# EAGLE schematic ra8875_ez80_2_1 (EAGLE 7.3.0)
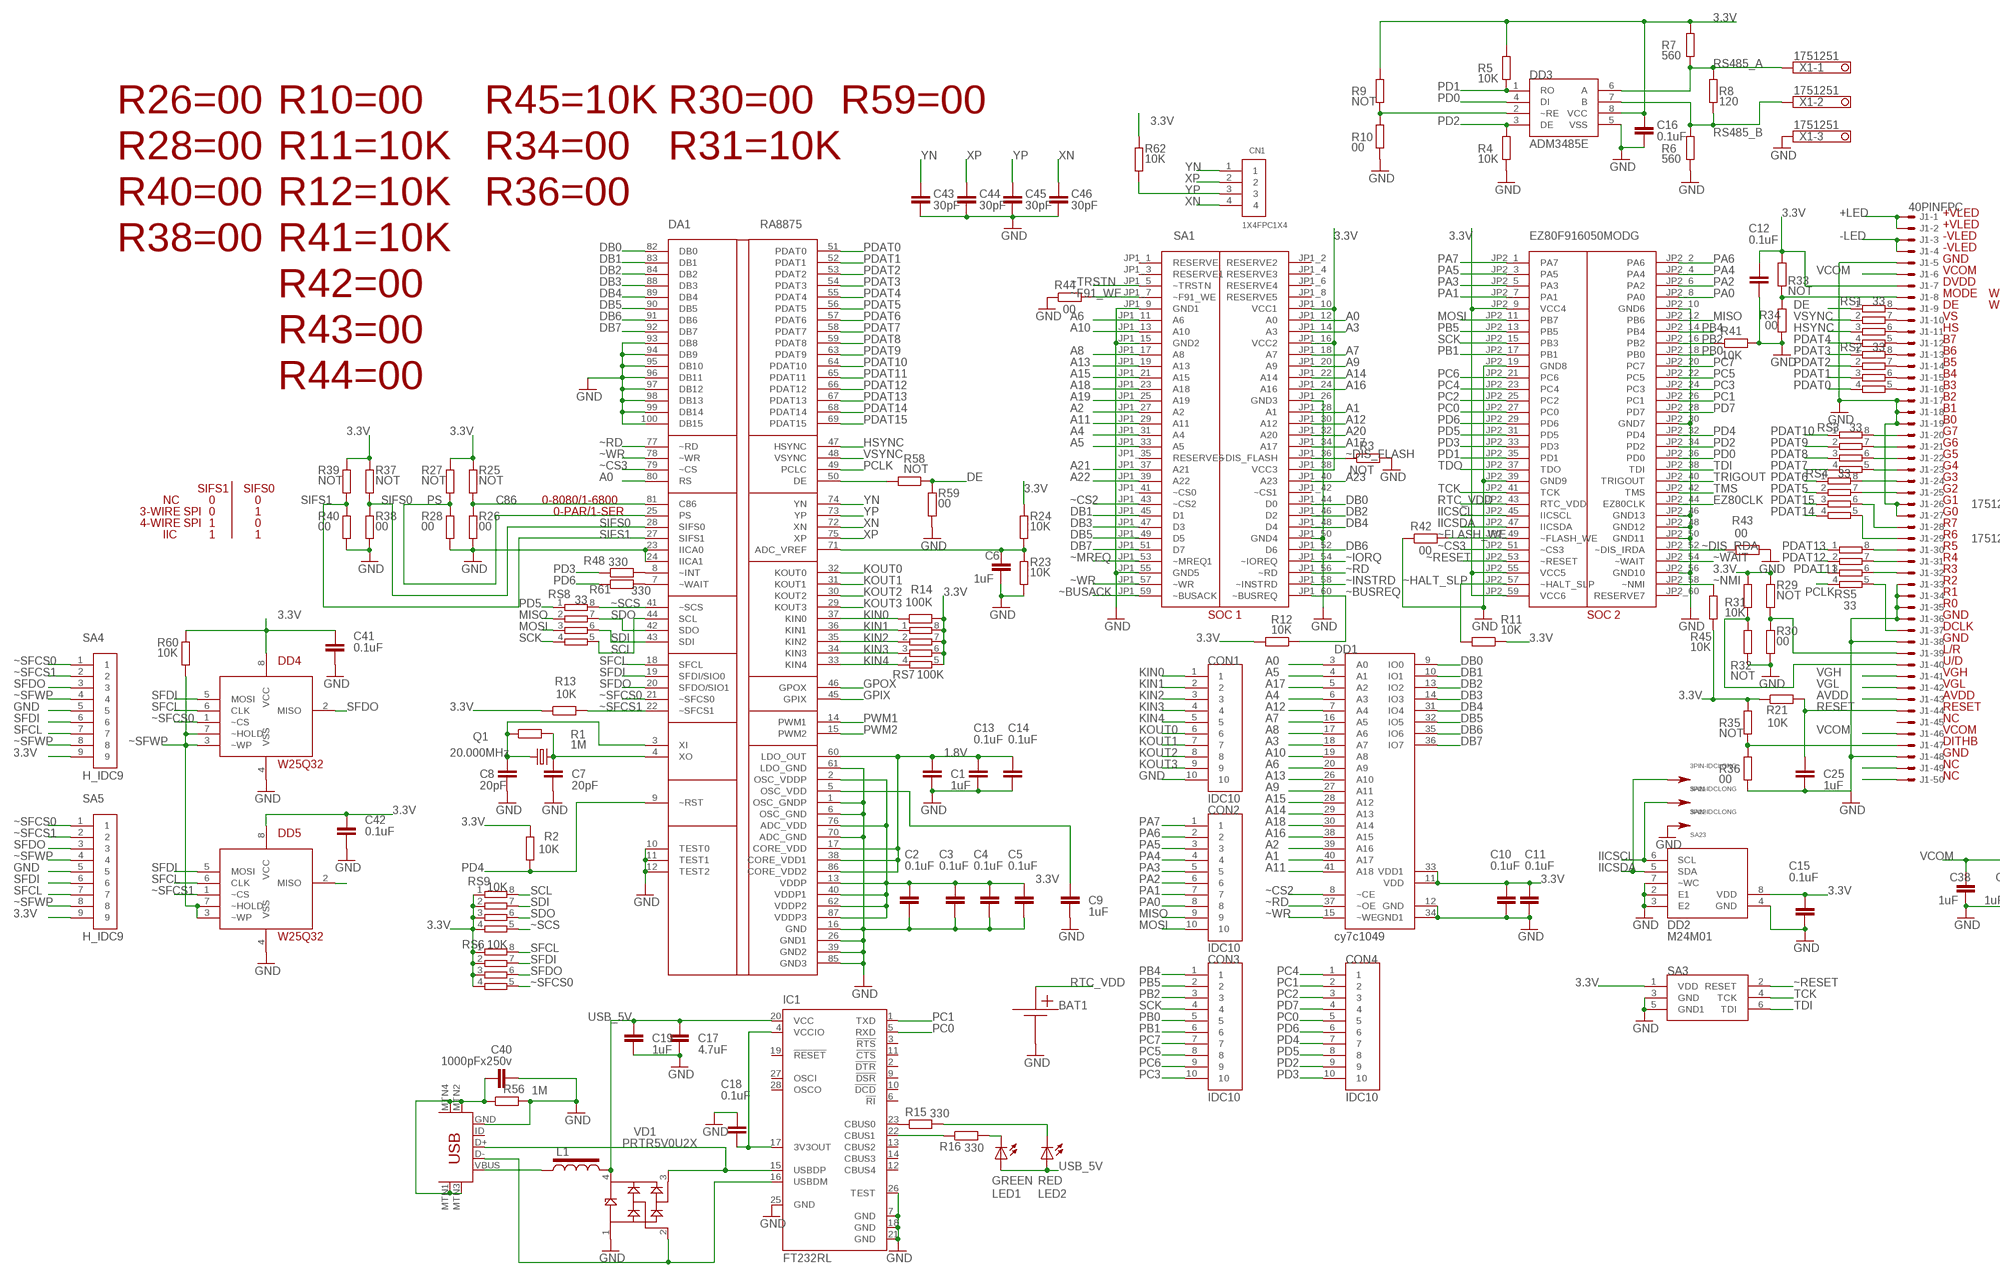
[diagram p0: schematic, sheet 1, part 1 of 2]
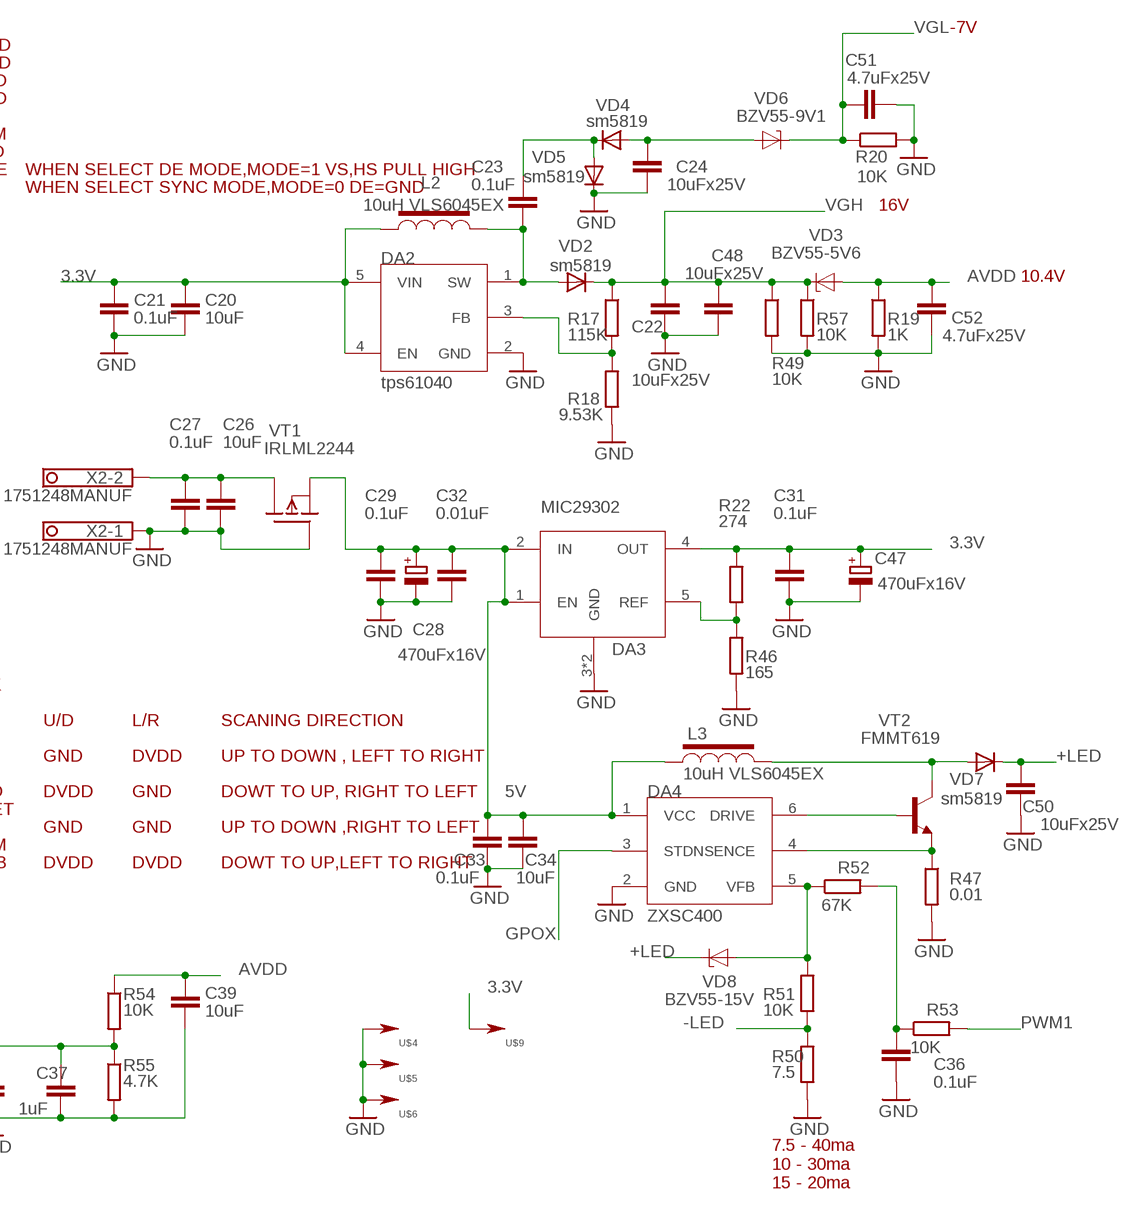
[diagram p1: schematic, sheet 1, part 2 of 2]

## Parts
BAT1  EECF5R5U155  [EECF5R5U155]
C1  1uF  C-EUC0603  [C0603]
C2  0.1uF  C-EUC0603  [C0603]
C3  0.1uF  C-EUC0603  [C0603]
C4  0.1uF  C-EUC0603  [C0603]
C5  0.1uF  C-EUC0603  [C0603]
C6  1uF  C-EUC0603  [C0603]
C7  20pF  C-EUC0805  [C0805]
C8  20pF  C-EUC0805  [C0805]
C9  1uF  C-EUC0603  [C0603]
C10  0.1uF  C-EUC0603  [C0603]
C11  0.1uF  C-EUC0603  [C0603]
C12  0.1uF  C-EUC0603  [C0603]
C13  0.1uF  C-EUC0603  [C0603]
C14  0.1uF  C-EUC0603  [C0603]
C15  0.1uF  C-EUC0603  [C0603]
C16  0.1uF  C-EUC0603  [C0603]
C17  4.7uF  C-EUC0805  [C0805]
C18  0.1uF  C-EUC0603  [C0603]
C19  1uF  C-EUC0603  [C0603]
C20  10uF  C-EUC1206  [C1206]
C21  0.1uF  C-EUC0805  [C0805]
C22  10uFx25V  C-EUC1206  [C1206]
C23  0.1uF  C-EUC1206  [C1206]
C24  10uFx25V  C-EUC1206  [C1206]
C25  1uF  C-EUC0603  [C0603]
C26  10uF  C-EUC1206  [C1206]
C27  0.1uF  C-EUC0805  [C0805]
C28  470uFx16V  CPOL-EUSMCD  [SMC_D]
C29  0.1uF  C-EUC0805  [C0805]
C31  0.1uF  C-EUC0805  [C0805]
C32  0.01uF  C-EUC0805  [C0805]
C33  0.1uF  C-EUC0805  [C0805]
C34  10uF  C-EUC1206  [C1206]
C36  0.1uF  C-EUC0805  [C0805]
C37  1uF  C-EUC0603  [C0603]
C38  1uF  C-EUC0603  [C0603]
C39  10uF  C-EUC1206  [C1206]
C40  1000pFx250v  C-EUC1812  [C1812]
C41  0.1uF  C-EUC0603  [C0603]
C42  0.1uF  C-EUC0603  [C0603]
C43  30pF  C-EUC0603  [C0603]
C44  30pF  C-EUC0603  [C0603]
C45  30pF  C-EUC0603  [C0603]
C46  30pF  C-EUC0603  [C0603]
C47  470uFx16V  CPOL-EUSMCD  [SMC_D]
C48  10uFx25V  C-EUC1206  [C1206]
C50  10uFx25V  C-EUC1206  [C1206]
C51  4.7uFx25V  C-EUC1206  [C1206]
C52  4.7uFx25V  C-EUC1206  [C1206]
CN1  1X4FPC1X4  [FPC_1MM-4]
CON1  IDC10  [IDC10]
CON2  IDC10  [IDC10]
CON3  IDC10  [IDC10]
CON4  IDC10  [IDC10]
DA1  RA8875  [LQFP100]
DA2  tps61040  TPS61040  [SOT23-5L]
DA3  MIC29302  MIC29302TO263-5  [TO263-5]
DA4  ZXSC400  ZXSC400LONG  [SOT23-6L]
DD1  cy7c1049  CY7C1049DV33  [TSOP_Z44_II]
DD2  M24M01  M24M01SOIC8  [SOIC8]
DD3  ADM3485E  ADM3485ESOIC8  [SO8]
DD4  W25Q32  W25Q32SOIC208  [SOIC-208]
DD5  W25Q32  W25Q32SOIC208  [SOIC-208]
IC1  FT232RL  [SSOP28]
J1  40PINFPC  [4-1734839-0]
L1  USB_INDUCTOR  [R0805]
L2  10uH VLS6045EX  INDUCTOR6045  [VLS6045]
L3  10uH VLS6045EX  INDUCTOR6045  [VLS6045]
LED1  GREEN  LEDCHIPLED_1206  [CHIPLED_1206]
LED2  RED  LEDCHIPLED_1206  [CHIPLED_1206]
Q1  20.000MHz  CRYSTALHC49U70  [HC49U70]
R1  1M  R-EU_R0603  [R0603]
R2  10K  R-EU_R0603  [R0603]
R3  NOT  R-EU_R0603  [R0603]
R4  10K  R-EU_R0603  [R0603]
R5  10K  R-EU_R0603  [R0603]
R6  560  R-EU_R0603  [R0603]
R7  560  R-EU_R0603  [R0603]
R8  120  R-EU_R0603  [R0603]
R9  NOT  R-EU_R0603  [R0603]
R10  00  R-EU_R0603  [R0603]
R11  10K  R-EU_R0603  [R0603]
R12  10K  R-EU_R0603  [R0603]
R13  10K  R-EU_R0603  [R0603]
R14  100K  R-EU_R0603  [R0603]
R15  330  R-EU_R0603  [R0603]
R16  330  R-EU_R0603  [R0603]
R17  115K  R-EU_R0805  [R0805]
R18  9.53K  R-EU_R0805  [R0805]
R19  1K  R-EU_R0805  [R0805]
R20  10K  R-EU_R0805  [R0805]
R21  10K  R-EU_R0603  [R0603]
R22  274  R-EU_R0805  [R0805]
R23  10K  R-EU_R0603  [R0603]
R24  10K  R-EU_R0603  [R0603]
R25  NOT  R-EU_R0603  [R0603]
R26  00  R-EU_R0603  [R0603]
R27  NOT  R-EU_R0603  [R0603]
R28  00  R-EU_R0603  [R0603]
R29  NOT  R-EU_R0603  [R0603]
R30  00  R-EU_R0603  [R0603]
R31  10K  R-EU_R0603  [R0603]
R32  NOT  R-EU_R0603  [R0603]
R33  NOT  R-EU_R0603  [R0603]
R34  00  R-EU_R0603  [R0603]
R35  NOT  R-EU_R0603  [R0603]
R36  00  R-EU_R0603  [R0603]
R37  NOT  R-EU_R0603  [R0603]
R38  00  R-EU_R0603  [R0603]
R39  NOT  R-EU_R0603  [R0603]
R40  00  R-EU_R0603  [R0603]
R41  10K  R-EU_R0603  [R0603]
R42  00  R-EU_R0603  [R0603]
R43  00  R-EU_R0603  [R0603]
R44  00  R-EU_R0603  [R0603]
R45  10K  R-EU_R0603  [R0603]
R46  165  R-EU_R0805  [R0805]
R47  0.01  R-EU_R2512  [R2512]
R48  330  R-EU_R0603  [R0603]
R49  10K  R-EU_R1206  [R1206]
R50  7.5  R-EU_R0805  [R0805]
R51  10K  R-EU_R0603  [R0603]
R52  67K  R-EU_R0603  [R0603]
R53  10K  R-EU_R0603  [R0603]
R54  10K  R-EU_R0603  [R0603]
R55  4.7K  R-EU_R0603  [R0603]
R56  1M  R-EU_R1206  [R1206]
R57  10K  R-EU_R1206  [R1206]
R58  NOT  R-EU_R0603  [R0603]
R59  00  R-EU_R0603  [R0603]
R60  10K  R-EU_R0603  [R0603]
R61  330  R-EU_R0603  [R0603]
R62  10K  R-EU_R0603  [R0603]
RS1  33  MULTI_RESISRORCAY16-4  [CAY16-4]
RS2  33  MULTI_RESISRORCAY16-4  [CAY16-4]
RS3  33  MULTI_RESISRORCAY16-4  [CAY16-4]
RS4  33  MULTI_RESISRORCAY16-4  [CAY16-4]
RS5  33  MULTI_RESISRORCAY16-4  [CAY16-4]
RS6  10K  MULTI_RESISRORCAY16-4  [CAY16-4]
RS7  100K  MULTI_RESISRORCAY16-4  [CAY16-4]
RS8  33  MULTI_RESISRORCAY16-4  [CAY16-4]
RS9  10K  MULTI_RESISRORCAY16-4  [CAY16-4]
SA1  EZ80F916050MODG  [EZ80F916050MODG]
SA2  3PIN-IDCLONG  [3PIN-254]
SA3  ZPAKII  [ZPAKII]
SA4  H_IDC9  [H_IDC8X1_27]
SA5  H_IDC9  [H_IDC8X1_27]
U$3  USB-MINIB-5PIN  [USB-MINIB]
U$4  1-PIN2_54  [1_PIN_2_54]
U$5  1-PIN2_54  [1_PIN_2_54]
U$6  1-PIN2_54  [1_PIN_2_54]
U$9  1-PIN2_54  [1_PIN_2_54]
VD1  PRTR5V0U2X  [SOT143B]
VD2  sm5819  SM5819  [MELF-MLL41]
VD3  BZV55-5V6  STABILITRONSMD  [STABILITRON]
VD4  sm5819  SM5819  [MELF-MLL41]
VD5  sm5819  SM5819  [MELF-MLL41]
VD6  BZV55-9V1  STABILITRONSMD  [STABILITRON]
VD7  sm5819  SM5819  [MELF-MLL41]
VD8  BZV55-15V  STABILITRONSMD  [STABILITRON]
VT1  IRLML2244  P-MOSFETSOT23  [SOT23]
VT2  FMMT619  BC847B-NPN-SOT23-BEC  [SOT23-BEC]
X1  1751251  [1751251]
X2  1751248MANUF  [1751248]

## Nets
1.8V: C1.1 C13.1 C14.1 DA1.17(CORE_VDD) DA1.38(CORE_VDD1) DA1.60(LDO_OUT) DA1.86(CORE_VDD2)
3.3V: C2.1 C3.1 C4.1 C5.1 C10.1 C11.1 C12.1 C15.1 C16.1 C20.1 C21.1 C31.1 C41.1 C42.1 C47.+ DA1.2(OSC_VDDP) DA1.13(VDDP) DA1.40(VDDP1) DA1.62(VDDP2) DA1.76(ADC_VDD) DA1.87(VDDP3) DA2.4(EN) DA2.5(VIN) DA3.4(OUT) DD1.11(VDD) DD1.33(VDD1) DD2.8(VDD) DD3.8(VCC) DD4.8(VCC) DD5.8(VCC) J1.7 L2.P$1(L1) R2.2 R5.1 R7.1 R9.1 R11.1 R12.2 R13.1 R14.2 R21.1 R22.1 R24.1 R25.1 R27.1 R29.1 R31.1 R33.1 R35.1 R37.1 R39.1 R45.2 R60.1 R62.1 RS6.1 RS6.2 RS6.3 RS6.4 RS7.5 RS7.6 RS7.7 RS7.8 RS9.1 RS9.2 RS9.3 RS9.4 SA1.JP1_10(VCC1) SA1.JP1_16(VCC2) SA1.JP1_38(VCC3) SA1.JP2_9(VCC4) SA1.JP2_55(VCC5) SA1.JP2_59(VCC6) SA3.1(VDD) SA4.9 SA5.9 U$9.P$1(S)
5V: C28.+ C29.1 C32.1 C33.1 C34.1 DA3.1(EN) DA3.2(IN) DA4.1(VCC) L3.P$1(L1) VT1.2(S)
+LED: C50.1 J1.1 J1.2 VD7.C VD8.C
-LED: J1.3 J1.4 R50.1 R51.2
A0: DA1.80(RS) DD1.3(A0) SA1.JP1_12(A0)
A1: DD1.40(A17) SA1.JP1_28(A1)
A2: DD1.39(A16) SA1.JP1_27(A2)
A3: DD1.18(A7) SA1.JP1_14(A3)
A4: DD1.6(A3) SA1.JP1_31(A4)
A5: DD1.4(A1) SA1.JP1_33(A5)
A6: DD1.20(A9) SA1.JP1_11(A6)
A7: DD1.16(A5) SA1.JP1_18(A7)
A8: DD1.17(A6) SA1.JP1_17(A8)
A9: DD1.27(A11) SA1.JP1_20(A9)
A10: DD1.19(A8) SA1.JP1_13(A10)
A11: DD1.41(A18) SA1.JP1_29(A11)
A12: DD1.7(A4) SA1.JP1_30(A12)
A13: DD1.26(A10) SA1.JP1_19(A13)
A14: DD1.29(A13) SA1.JP1_22(A14)
A15: DD1.28(A12) SA1.JP1_21(A15)
A16: DD1.38(A15) SA1.JP1_24(A16)
A17: DD1.5(A2) SA1.JP1_34(A17)
A18: DD1.30(A14) SA1.JP1_23(A18)
A19: SA1.JP1_25(A19)
A20: SA1.JP1_32(A20)
A21: SA1.JP1_37(A21)
A22: SA1.JP1_39(A22)
A23: SA1.JP1_40(A23)
ADC_VREF: C6.1 DA1.71(ADC_VREF) R23.1 R24.2
AVDD: C39.1 C52.1 J1.43 R19.1 R54.1 VD3.A
C86: DA1.81(C86) R25.2 R26.1
DB0: DA1.82(DB0) DD1.9(IO0) SA1.JP1_44(D0)
DB1: DA1.83(DB1) DD1.10(IO1) SA1.JP1_45(D1)
DB2: DA1.84(DB2) DD1.13(IO2) SA1.JP1_46(D2)
DB3: DA1.88(DB3) DD1.14(IO3) SA1.JP1_47(D3)
DB4: DA1.89(DB4) DD1.31(IO4) SA1.JP1_48(D4)
DB5: DA1.90(DB5) DD1.32(IO5) SA1.JP1_49(D5)
DB6: DA1.91(DB6) DD1.35(IO6) SA1.JP1_52(D6)
DB7: DA1.92(DB7) DD1.36(IO7) SA1.JP1_51(D7)
DE: R58.1 R59.1 RS1.1
EZ80CLK: SA1.JP2_44(EZ80CLK)
GND: BAT1.-(MINUS) C1.2 C2.2 C3.2 C4.2 C5.2 C6.2 C7.2 C8.2 C9.2 C10.2 C11.2 C12.2 C13.2 C14.2 C15.2 C16.2 C17.2 C18.1 C19.2 C20.2 C21.2 C22.2 C24.2 C25.2 C26.2 C27.2 C28.- C29.2 C31.2 C32.2 C33.2 C34.2 C36.2 C37.2 C38.2 C39.2 C40.2 C41.2 C42.2 C43.2 C44.2 C45.2 C46.2 C47.- C48.2 C50.2 C51.2 C52.2 CON1.10 DA1.1(OSC_GNDP) DA1.6(OSC_GND) DA1.10(TEST0) DA1.11(TEST1) DA1.12(TEST2) DA1.16(GND) DA1.23(IICA0) DA1.24(IICA1) DA1.26(GND1) DA1.39(GND2) DA1.61(LDO_GND) DA1.70(ADC_GND) DA1.85(GND3) DA1.93(DB8) DA1.94(DB9) DA1.95(DB10) DA1.96(DB11) DA1.97(DB12) DA1.98(DB13) DA1.99(DB14) DA1.100(DB15) DA2.2(GND) DA3.3(GND) DA3.6(GND) DA4.2(GND) DD1.12(GND) DD1.34(GND1) DD2.2(E1) DD2.3(E2) DD2.4(GND) DD2.7(~WC) DD3.5(VSS) DD4.4(VSS) DD5.4(VSS) IC1.7(GND) IC1.18(GND) IC1.21(GND) IC1.25(GND) IC1.26(TEST) J1.5 J1.17 J1.18 J1.19 J1.26 J1.27 J1.33 J1.34 J1.35 J1.36 J1.38 J1.48 R3.2 R4.2 R6.2 R10.2 R18.2 R19.2 R20.2 R23.2 R26.2 R28.2 R30.2 R32.2 R34.2 R36.2 R38.2 R40.2 R41.2 R42.1 R43.2 R44.1 R46.2 R47.2 R49.2 R50.2 R55.2 R56.2 R57.2 R59.2 SA1.JP1_9(GND1) SA1.JP1_15(GND2) SA1.JP1_26(GND3) SA1.JP1_50(GND4) SA1.JP1_55(GND5) SA1.JP2_10(GND6) SA1.JP2_19(GND8) SA1.JP2_30(GND7) SA1.JP2_39(GND9) SA1.JP2_46(GND13) SA1.JP2_48(GND12) SA1.JP2_50(GND11) SA1.JP2_56(GND10) SA2.3 SA3.3(GND) SA3.5(GND1) SA4.5 SA5.5 U$3.GND U$4.P$1(S) U$5.P$1(S) U$6.P$1(S) VD1.1(GND) VD5.C VT1.1(G) X1.3 X2.1
GPIX: DA1.45(GPIX)
GPOX: DA1.46(GPOX) DA4.3(STDN)
HSYNC: DA1.47(HSYNC) RS1.3
IICSCL: DD2.6(SCL) SA1.JP2_45(IICSCL) SA2.2
IICSDA: DD2.5(SDA) SA1.JP2_47(IICSDA) SA2.1
KIN0: CON1.1 DA1.37(KIN0) R14.1
KIN1: CON1.2 DA1.36(KIN1) RS7.1
KIN2: CON1.3 DA1.35(KIN2) RS7.2
KIN3: CON1.4 DA1.34(KIN3) RS7.3
KIN4: CON1.5 DA1.33(KIN4) RS7.4
KOUT0: CON1.6 DA1.32(KOUT0)
KOUT1: CON1.7 DA1.31(KOUT1)
KOUT2: CON1.8 DA1.30(KOUT2)
KOUT3: CON1.9 DA1.29(KOUT3)
MISO: CON2.9 RS8.2 SA1.JP2_12(PB6)
MOSI: CON2.10 RS8.3 SA1.JP2_11(PB7)
N$1: DD3.2(~RE) R9.2 R10.1
N$2: L1.1(L1) U$3.VBUS
N$3: IC1.16(USBDM) U$3.D- VD1.2(IO1)
N$4: C18.2 IC1.4(VCCIO) IC1.17(3V3OUT)
N$5: IC1.15(USBDP) U$3.D+ VD1.3(IO2)
N$6: C23.2 DA2.1(SW) L2.P$2(L2) VD2.A
N$8: DA2.3(FB) R17.2 R18.1
N$9: C24.1 VD4.A VD6.A
N$10: C26.1 C27.1 VT1.3(D) X2.2
N$11: DA1.8(~INT) R48.2
N$12: DA3.5(REF) R22.2 R46.1
N$13: C8.1 DA1.3(XI) Q1.1 R1.1
N$14: C7.1 DA1.4(XO) Q1.2 R1.2
N$15: IC1.23(CBUS0) R15.1
N$16: C9.1 DA1.5(OSC_VDD)
N$17: C36.1 R52.2 R53.1
N$18: J1.24 RS4.8
N$19: J1.20 RS3.8
N$20: J1.21 RS3.7
N$21: J1.22 RS3.6
N$22: J1.23 RS3.5
N$23: J1.28 RS4.6
N$24: J1.29 RS4.5
N$25: J1.25 RS4.7
N$26: J1.30 RS5.8
N$27: J1.31 RS5.7
N$28: DA4.5(VFB) R51.1 R52.1 VD8.A
N$29: C40.1 R56.1 U$3.MTN1(MTN2) U$3.MTN2(MTN3) U$3.MTN3(MTN1) U$3.MTN4
N$30: DA1.50(DE) R58.2
N$31: J1.47 R35.2 R36.1
N$32: DA4.6(DRIVE) VT2.B
N$33: IC1.22(CBUS1) R16.1
N$34: LED2.C R15.2
N$35: LED1.C R16.2
N$36: L3.P$2(L2) VD7.A VT2.C
N$37: C23.1 VD4.C VD5.A
N$38: J1.8 R33.2 R34.1
N$39: DA1.7(~WAIT) R61.2
N$40: DA4.4(SENCE) R47.1 VT2.E
N$50: J1.32 RS5.6
N$51: J1.37 RS5.5
N$61: J1.9 RS1.8
N$62: J1.10 RS1.7
N$63: J1.11 RS1.6
N$64: J1.12 RS1.5
N$65: J1.13 RS2.8
N$66: J1.14 RS2.7
N$67: J1.15 RS2.6
N$68: J1.16 RS2.5
N$77: J1.39 R29.2 R30.1
N$78: J1.40 R31.2 R32.1
N$87: J1.49
N$88: J1.50
PA0: CON2.8 SA1.JP2_8(PA0)
PA1: CON2.7 SA1.JP2_7(PA1)
PA2: CON2.6 SA1.JP2_6(PA2)
PA3: CON2.5 SA1.JP2_5(PA3)
PA4: CON2.4 SA1.JP2_4(PA4)
PA5: CON2.3 SA1.JP2_3(PA5)
PA6: CON2.2 SA1.JP2_2(PA6)
PA7: CON2.1 SA1.JP2_1(PA7)
PB0: CON3.5 SA1.JP2_18(PB0)
PB1: CON3.6 SA1.JP2_17(PB1)
PB2: CON3.3 R41.1 SA1.JP2_16(PB2)
PB4: CON3.1 SA1.JP2_14(PB4)
PB5: CON3.2 SA1.JP2_13(PB5)
PC0: CON4.5 IC1.5(RXD) SA1.JP2_27(PC0)
PC1: CON4.2 IC1.1(TXD) SA1.JP2_26(PC1)
PC2: CON4.3 SA1.JP2_25(PC2)
PC3: CON3.10 SA1.JP2_24(PC3)
PC4: CON4.1 SA1.JP2_23(PC4)
PC5: CON3.8 SA1.JP2_22(PC5)
PC6: CON3.9 SA1.JP2_21(PC6)
PC7: CON3.7 SA1.JP2_20(PC7)
PCLK: DA1.49(PCLC) RS5.4
PD0: DD3.4(DI) SA1.JP2_36(PD0)
PD1: DD3.1(RO) R5.2 SA1.JP2_35(PD1)
PD2: CON4.9 DD3.3(DE) R4.1 SA1.JP2_34(PD2)
PD3: CON4.10 R48.1 SA1.JP2_33(PD3)
PD4: CON4.7 DA1.9(~RST) R2.1 SA1.JP2_32(PD4)
PD5: CON4.8 RS8.1 SA1.JP2_31(PD5)
PD6: CON4.6 R61.1 SA1.JP2_29(PD6)
PD7: CON4.4 SA1.JP2_28(PD7)
PDAT0: DA1.51(PDAT0) RS2.4
PDAT1: DA1.52(PDAT1) RS2.3
PDAT2: DA1.53(PDAT2) RS2.2
PDAT3: DA1.54(PDAT3) RS2.1
PDAT4: DA1.55(PDAT4) RS1.4
PDAT5: DA1.56(PDAT5) RS4.2
PDAT6: DA1.57(PDAT6) RS4.1
PDAT7: DA1.58(PDAT7) RS3.4
PDAT8: DA1.59(PDAT8) RS3.3
PDAT9: DA1.63(PDAT9) RS3.2
PDAT10: DA1.64(PDAT10) RS3.1
PDAT11: DA1.65(PDAT11) RS5.3
PDAT12: DA1.66(PDAT12) RS5.2
PDAT13: DA1.67(PDAT13) RS5.1
PDAT14: DA1.68(PDAT14) RS4.4
PDAT15: DA1.69(PDAT15) RS4.3
PS: DA1.25(PS) R27.2 R28.1
PWM1: DA1.14(PWM1) R53.2
PWM2: DA1.15(PWM2)
RESET: C25.1 J1.44 R21.2
RS485_A: DD3.6(A) R7.2 R8.1 X1.1
RS485_B: DD3.7(B) R6.1 R8.2 X1.2
RTC_VDD: BAT1.+(PLUS) SA1.JP2_43(RTC_VDD)
SCK: CON3.4 RS8.4 SA1.JP2_15(PB3)
SCL: DA1.44(SCL) RS8.5 RS9.8
SDI: DA1.43(SDI) RS8.6 RS9.7
SDO: DA1.42(SDO) RS8.7 RS9.6
SFCL: DA1.18(SFCL) DD4.6(CLK) DD5.6(CLK) RS6.8 SA4.7 SA5.7
SFDI: DA1.19(SFDI/SIO0) DD4.5(MOSI) DD5.5(MOSI) RS6.7 SA4.6 SA5.6
SFDO: DA1.20(SFDO/SIO1) DD4.2(MISO) DD5.2(MISO) RS6.6 SA4.3 SA5.3
SIFS0: DA1.28(SIFS0) R37.2 R38.1
SIFS1: DA1.27(SIFS1) R39.2 R40.1
TCK: SA1.JP2_41(TCK) SA3.4(TCK)
TDI: SA1.JP2_38(TDI) SA3.6(TDI)
TDO: SA1.JP2_37(TDO)
TMS: SA1.JP2_42(TMS)
TRIGOUT: SA1.JP2_40(TRIGOUT)
USB_5V: C17.1 C19.1 IC1.20(VCC) L1.2(L2) LED1.A LED2.A VD1.4(VCC)
VCOM: C37.1 C38.1 J1.6 J1.46 R54.2 R55.1
VGH: C22.1 C48.1 J1.41 R17.1 R49.1 R57.1 VD2.C VD3.C
VGL: C51.1 J1.42 R20.1 VD6.C
VSYNC: DA1.48(VSYNC) RS1.2
XN: C46.1 CN1.4 DA1.72(XN)
XP: C44.1 CN1.2 DA1.75(XP)
YN: C43.1 CN1.1 DA1.74(YN)
YP: C45.1 CN1.3 DA1.73(YP) R62.2
~BUSACK: SA1.JP1_59(~BUSACK)
~BUSREQ: R12.1 SA1.JP1_60(~BUSREQ)
~CS2: DD1.8(~CE) SA1.JP1_43(~CS2)
~CS3: DA1.79(~CS) SA1.JP2_51(~CS3)
~DIS_FLASH: R3.1 SA1.JP1_36(~DIS_FLASH)
~DIS_RDA: R43.1 SA1.JP2_52(~DIS_IRDA)
~F91_WE: R44.2 SA1.JP1_7(~F91_WE)
~FLASH_WE: R42.2 SA1.JP2_49(~FLASH_WE)
~HALT_SLP: R11.2 SA1.JP2_57(~HALT_SLP)
~INSTRD: SA1.JP1_58(~INSTRD)
~IORQ: SA1.JP1_54(~IOREQ)
~MREQ: SA1.JP1_53(~MREQ1)
~NMI: R45.1 SA1.JP2_58(~NMI)
~RD: DA1.77(~RD) DD1.37(~OE) SA1.JP1_56(~RD)
~RESET: SA1.JP2_53(~RESET) SA3.2(RESET)
~SCS: DA1.41(~SCS) RS8.8 RS9.5
~SFCS0: DA1.21(~SFCS0) DD4.1(~CS) RS6.5 SA4.1 SA5.1
~SFCS1: DA1.22(~SFCS1) DD5.1(~CS) R13.2 SA4.2 SA5.2
~SFWP: DD4.3(~WP) DD4.7(~HOLD) DD5.3(~WP) DD5.7(~HOLD) R60.2 SA4.4 SA4.8 SA5.4 SA5.8
~TRSTN: SA1.JP1_5(~TRSTN)
~WAIT: SA1.JP2_54(~WAIT)
~WR: DA1.78(~WR) DD1.15(~WE) SA1.JP1_57(~WR)
Unconnected: IC1.2(!DTR) IC1.3(!RTS) IC1.6(!RI) IC1.9(!DSR) IC1.10(!DCD) IC1.11(!CTS) IC1.12(CBUS4) IC1.13(CBUS2) IC1.14(CBUS3) IC1.19(!RESET) IC1.27(OSCI) IC1.28(OSCO) J1.45 SA1.JP1_1(RESERVE) SA1.JP1_2(RESERVE2) SA1.JP1_3(RESERVE1) SA1.JP1_4(RESERVE3) SA1.JP1_6(RESERVE4) SA1.JP1_8(RESERVE5) SA1.JP1_35(RESERVE6) SA1.JP1_41(~CS0) SA1.JP1_42(~CS1) SA1.JP2_60(RESERVE7) U$3.ID

## Notes on the sheet
- R26=00 | R10=00 | R45=10K | R30=00 | R59=00
- R28=00 | R11=10K | R34=00 | R31=10K
- R40=00 | R12=10K | R36=00 | -7V
- +VLED
- +VLED
- -VLED
- R38=00 | R41=10K | -VLED
- GND
- VCOM
- DVDD
- R42=00 | MODE | WHEN SELECT DE MODE,MODE=1 VS,HS PULL HIGH
- DE | WHEN SELECT SYNC MODE,MODE=0 DE=GND
- VS | 16V
- HS
- R43=00 | B7
- B6
- B5 | 10.4V
- B4
- R44=00 | B3
- B2
- B1
- B0
- G7
- G6
- G5
- G4
- G3
- SIFS1 | SIFS0 | G2
- NC | 0 | 0 | 0-8080/1-6800 | G1
- 3-WIRE SPI | 0 | 1 | 0-PAR/1-SER | G0
- 4-WIRE SPI | 1 | 0 | R7
- IIC | 1 | 1 | R6
- R5
- R4
- R3
- R2
- R1
- R0
- GND
- DCLK
- GND
- L/R | U/D | L/R | SCANING DIRECTION
- U/D
- VGH | GND | DVDD | UP TO DOWN , LEFT TO RIGHT
- VGL
- AVDD | DVDD | GND | DOWT TO UP, RIGHT TO LEFT
- RESET
- NC | GND | GND | UP TO DOWN ,RIGHT TO LEFT
- VCOM
- DITHB | DVDD | DVDD | DOWT TO UP,LEFT TO RIGHT
- GND
- NC
- NC
- 7.5 - 40ma
  10 - 30ma
  15 - 20ma

## Library data of the parts
BAT1 = battery:EECF5R5U155
C1-C27 C29 C31-C34 C36-C46 C48 C50-C52 = resistor:C-EU: CAPACITOR, European symbol
C28 C47 = resistors:CPOL-EU: POLARIZED CAPACITOR, European symbol
CN1 = adafruit:1X4: 4-pin connector
CON1-CON4 = connectors:IDC10
DA1 = other_chips:RA8875
DA2 = power:TPS61040
DA3 = power:MIC29302
DA4 = power:ZXSC400
DD1 = ram:CY7C1049DV33
DD2 = eeprom:M24M01
DD3 = interface_ic:ADM3485E
DD4 DD5 = eeprom:W25Q32
IC1 = ftdichip:FT232R: Source: http://www.ftdichip.com/Documents/DataSheets/DS_FT232R_v104.pdf; MPN: FT232RL; OC_FARNELL: 1146032; OC_NEWARK: 91K9918
J1 = connectors:40PINFPC: OMRON FPC Connector Source : http://www.omron.com/ecb/products/pdf/fpc.pdf XF2M-4015-rev is good for connecting up 'PSP' SHARP LQ043 LCDs
L1 = inductors:USB_INDUCTOR
L2 L3 = inductors:INDUCTOR
LED1 LED2 = led:LED: LED OSRAM: - CHIPLED LG R971, LG N971, LY N971, LG Q971, LY Q971, LO R971, LY R971 LH N974, LH R974 LS Q976, LO Q976, LY Q976 LO Q996 - Hyper CHIPLED LW Q18S LB Q993, LB Q99A, LB R99A - SideLED LS A670, LO A670, LY A670, LG A670, LP A670 LB A673, LV A673, LT A673, LW A673 LH A674 LY A675 LS A676, LA A676, LO A676, LY A676, LW A676 LS A679, LY A679, LG A679 - Hyper Micro SIDELED® LS Y876, LA Y876, LO Y876, LY Y876 LT Y87S - SmartLED LW L88C, LW L88S LB L89C, LB L89S, LG L890 LS L89K, LO L89K, LY L89K LS L896, LA L896, LO L896, LY L896 - TOPLED LS T670, LO T670, LY T670, LG T670, LP T670 LSG T670, LSP T670, LSY T670, LOP T670, LYG T670 LG T671, LOG T671, LSG T671 LB T673, LV T673, LT T673, LW T673 LH T674 LS T676, LA T676, LO T676, LY T676, LB T676, LH T676, LSB T676, LW T676 LB T67C, LV T67C, LT T67C, LS T67K, LO T67K, LY T67K, LW E67C LS E67B, LA E67B, LO E67B, LY E67B, LB E67C, LV E67C, LT E67C LW T67C LS T679, LY T679, LG T679 LS T770, LO T770, LY T770, LG T770, LP T770 LB T773, LV T773, LT T773, LW T773 LH T774 LS E675, LA E675, LY E675, LS T675 LS T776, LA T776, LO T776, LY T776, LB T776 LHGB T686 LT T68C, LB T68C - Hyper Mini TOPLED® LB M676 - Mini TOPLED Santana® LG M470 LS M47K, LO M47K, LY M47K Source: http://www.osram.convergy.de LUXEON: - LUMILED® LXK2-PW12-R00, LXK2-PW12-S00, LXK2-PW14-U00, LXK2-PW14-V00 LXK2-PM12-R00, LXK2-PM12-S00, LXK2-PM14-U00 LXK2-PE12-Q00, LXK2-PE12-R00, LXK2-PE12-S00, LXK2-PE14-T00, LXK2-PE14-U00 LXK2-PB12-K00, LXK2-PB12-L00, LXK2-PB12-M00, LXK2-PB14-N00, LXK2-PB14-P00, LXK2-PB14-Q00 LXK2-PR12-L00, LXK2-PR12-M00, LXK2-PR14-Q00, LXK2-PR14-R00 LXK2-PD12-Q00, LXK2-PD12-R00, LXK2-PD12-S00 LXK2-PH12-R00, LXK2-PH12-S00 LXK2-PL12-P00, LXK2-PL12-Q00, LXK2-PL12-R00 Source: www.luxeon.com KINGBRIGHT: KA-3528ASYC Source: www.kingbright.com
Q1 = crystal:CRYSTAL: CRYSTAL; OC_FARNELL: unknown; OC_NEWARK: unknown
R1-R62 = resistor:R-EU_: RESISTOR, European symbol
RS1-RS9 = resistors:MULTI_RESISROR
SA1 = Zilog:EZ80F916050MODG
SA2 = connectors:3PIN-IDC
SA3 = Zilog:ZPAKII
SA4 SA5 = connectors:H_IDC9
U$3 = connectors:USB-MINIB: Mini-USB "B" connector with 5th pin broken out. Created new symbol breaking out 5th "ID" pin in mini/micro USB connector spec. See: http://en.wikipedia.org/wiki/Mini_usb#Cables. Uses same footprint as 4-pin symbol. Also added pins to connect to mounting / shield pads if required (probably not generally needed as signals aren't shielded once they leave the connector).
U$4-U$6 U$9 = connectors:1-PIN
VD1 = diodes:PRTR5V0U2X
VD2 VD4 VD5 VD7 = diodes:SM5819
VD3 VD6 VD8 = diodes:STABILITRON
VT1 = Tranzistors:P-MOSFET
VT2 = Tranzistors:*-NPN-: NPN Transistror BF959 corrected 2008.03.06
X1 = connectors:1751251: MKDS 1/ 3-3,5 Printklemme Nennstrom: 10 A Bemessungsspannung: 160 V Raster: 3,5 mm Polzahl: 3 Montageart: Löten Anschlussart: Schraubanschluss Anschlussrichtung vom Leiter zur Platine: 0° Source: http://eshop.phoenixcontact.com .. 1751251.pdf; OC_FARNELL: unknown; OC_NEWARK: unknown
X2 = connectors:1751248: MKDS 1/ 2-3,5 Printklemme Nennstrom: 10 A Bemessungsspannung: 160 V Raster: 3,5 mm Polzahl: 2 Montageart: Löten Anschlussart: Schraubanschluss Anschlussrichtung vom Leiter zur Platine: 0° Source: http://eshop.phoenixcontact.com .. 1751248.pdf; OC_FARNELL: unknown; OC_NEWARK: unknown